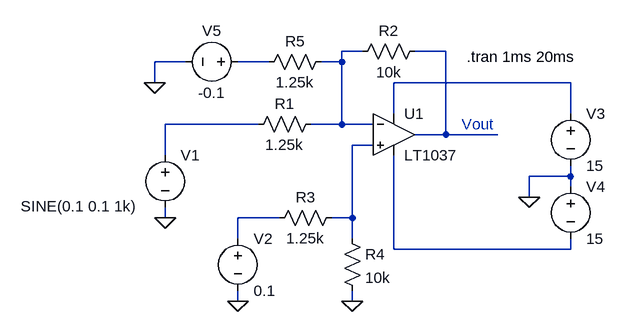
[diagram p0: schematic scheme3.asc]
scheme3.asc, the LTspice schematic file:
Version 4.1
SHEET 1 880 680
WIRE 304 -32 272 -32
WIRE 432 -32 384 -32
WIRE 32 -16 -16 -16
WIRE 160 -16 112 -16
WIRE 272 -16 272 -32
WIRE 272 -16 240 -16
WIRE -16 16 -16 -16
WIRE 624 16 352 16
WIRE 352 64 352 16
WIRE 624 64 624 16
WIRE 144 80 0 80
WIRE 272 80 272 -16
WIRE 272 80 224 80
WIRE 320 80 272 80
WIRE 432 96 432 -32
WIRE 432 96 384 96
WIRE 512 96 432 96
WIRE 320 112 288 112
WIRE 0 128 0 80
WIRE 624 160 624 144
WIRE 624 160 560 160
WIRE 624 176 624 160
WIRE 560 192 560 160
WIRE 0 224 0 208
WIRE 176 224 112 224
WIRE 288 224 288 112
WIRE 288 224 256 224
WIRE 112 256 112 224
WIRE 288 256 288 224
WIRE 352 272 352 128
WIRE 624 272 624 256
WIRE 624 272 352 272
WIRE 112 352 112 336
WIRE 288 352 288 336
FLAG 0 224 0
FLAG 112 352 0
FLAG 288 352 0
FLAG 560 192 0
FLAG -16 16 0
SYMBOL voltage 0 112 R0
WINDOW 3 -222 94 Left 2
WINDOW 123 0 0 Left 0
WINDOW 39 0 0 Left 0
SYMATTR Value SINE(0.1 0.1 1k)
SYMATTR InstName V1
SYMBOL voltage 112 240 R0
SYMATTR InstName V2
SYMATTR Value 0.1
SYMBOL res 240 64 R90
WINDOW 0 0 56 VBottom 2
WINDOW 3 32 56 VTop 2
SYMATTR InstName R1
SYMATTR Value 1.25k
SYMBOL res 400 -48 R90
WINDOW 0 0 56 VBottom 2
WINDOW 3 32 56 VTop 2
SYMATTR InstName R2
SYMATTR Value 10k
SYMBOL res 272 208 R90
WINDOW 0 0 56 VBottom 2
WINDOW 3 32 56 VTop 2
SYMATTR InstName R3
SYMATTR Value 1.25k
SYMBOL res 272 240 R0
SYMATTR InstName R4
SYMATTR Value 10k
SYMBOL OpAmps\\LT1037 352 32 R0
SYMATTR InstName U1
SYMBOL voltage 624 48 R0
SYMATTR InstName V3
SYMATTR Value 15
SYMBOL voltage 624 160 R0
SYMATTR InstName V4
SYMATTR Value 15
SYMBOL voltage 128 -16 R90
WINDOW 0 -32 56 VBottom 2
WINDOW 3 32 56 VTop 2
SYMATTR InstName V5
SYMATTR Value -0.1
SYMBOL res 256 -32 R90
WINDOW 0 0 56 VBottom 2
WINDOW 3 32 56 VTop 2
SYMATTR InstName R5
SYMATTR Value 1.25k
TEXT 464 -24 Left 2 !.tran 1ms 20ms
TEXT 456 80 Left 2 ;Vout

The netlist it stands for:
* scheme3.asc
V1 N005 0 SINE(0.1 0.1 1k)
V2 N007 0 0.1
R1 N001 N005 1.25k
R2 N002 N001 10k
R3 N006 N007 1.25k
R4 N006 0 10k
X§U1 N006 N001 N004 N008 N002 LT1037  ; pins In+ In- V+ V- OUT
V3 N004 0 15
V4 0 N008 15
V5 N003 0 -0.1
R5 N001 N003 1.25k
.tran 1ms 20ms
* Vout
.backanno
.end